# Altium schematic sheet [14]-CURRENT_METER.SchDoc
size A4
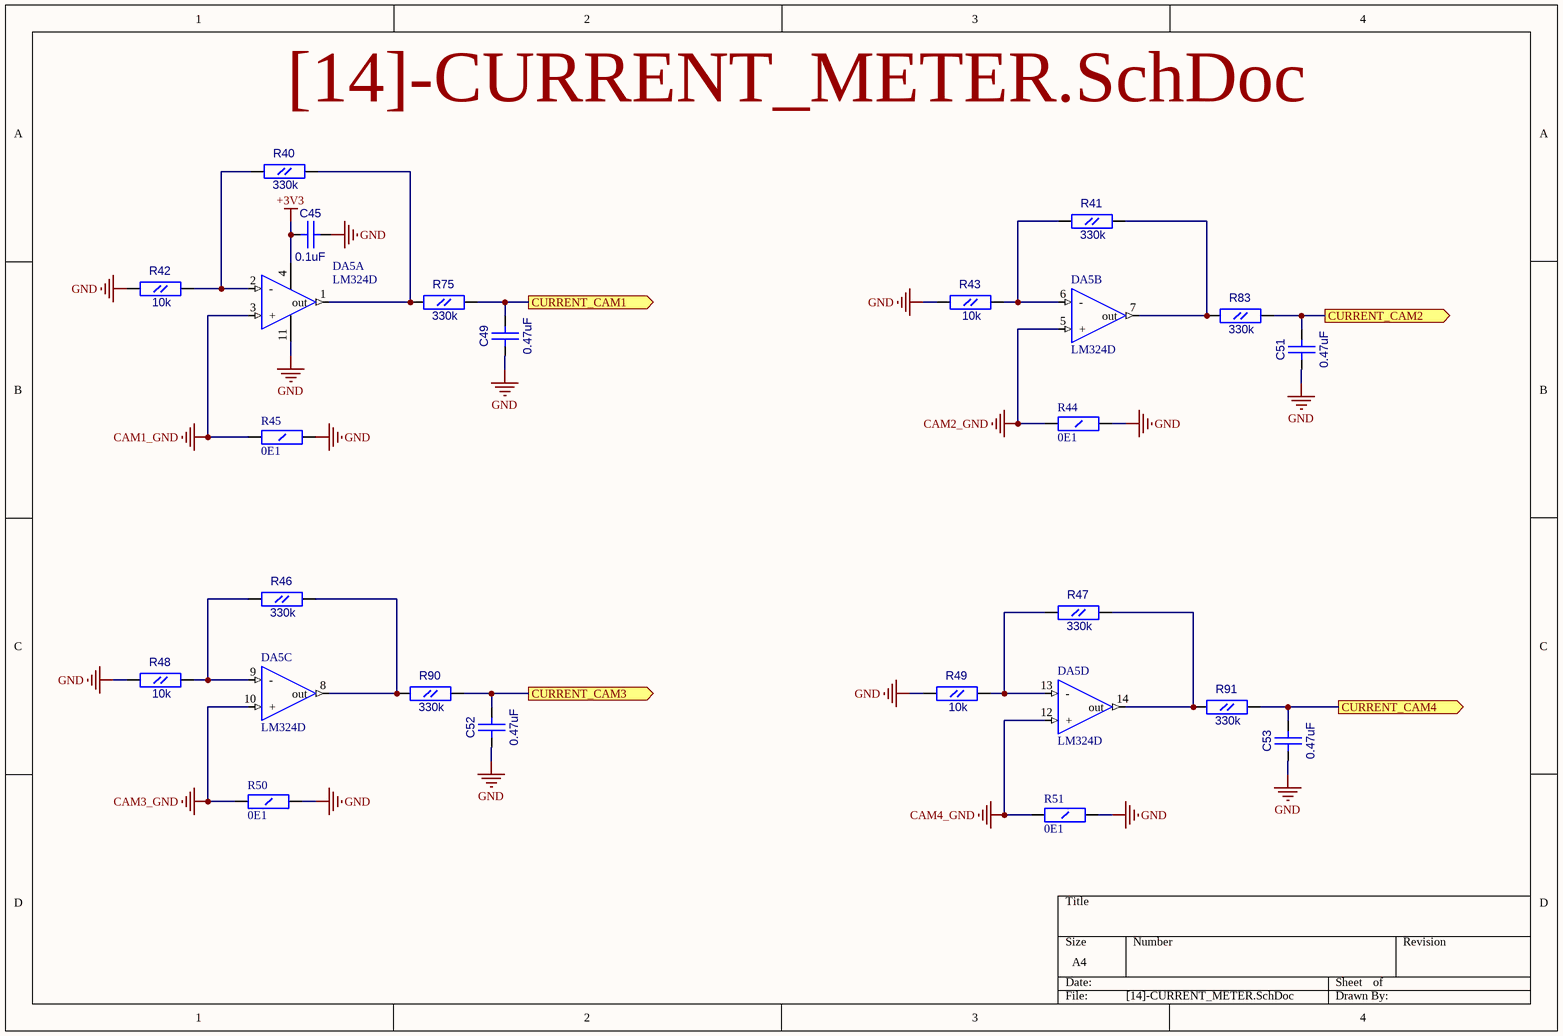
[diagram p0: [14]-CURRENT_METER.SchDoc]

## Parts
C45  0.1uF  [CC0603]
C49  0.47uF  [CC0603]
C51  0.47uF  [CC0603]
C52  0.47uF  [CC0603]
C53  0.47uF  [CC0603]
DA5  LM324D  [SO14]  (parts A,B,C,D of 4)
R40  330k  [RC0603]
R41  330k  [RC0603]
R42  10k  [RC0603]
R43  10k  [RC0603]
R44  0E1  [R2512]
R45  0E1  [R2512]
R46  330k  [RC0603]
R47  330k  [RC0603]
R48  10k  [RC0603]
R49  10k  [RC0603]
R50  0E1  [R2512]
R51  0E1  [R2512]
R75  330k  [RC0603]
R83  330k  [RC0603]
R90  330k  [RC0603]
R91  330k  [RC0603]

## Ports
CURRENT_CAM1 (out), CURRENT_CAM2 (out), CURRENT_CAM3 (out), CURRENT_CAM4 (out)

## Nets
+3V3: C45.1(A) DA5.4(V+)
CAM1_GND: DA5.3(+) R45.2(B)
CAM2_GND: DA5.5(+) R44.2(B)
CAM3_GND: DA5.10(+) R50.2(B)
CAM4_GND: DA5.12(+) R51.2(B)
GND: C45.2(B) C49.1(A) C51.1(A) C52.1(A) C53.1(A) DA5.11(V-) R42.1(A) R43.1(A) R44.1(A) R45.1(A) R48.1(A) R49.1(A) R50.1(A) R51.1(A)
CURRENT_CAM1: C49.2(B) R75.2(B) ; port CURRENT_CAM1
CURRENT_CAM2: C51.2(B) R83.2(B) ; port CURRENT_CAM2
CURRENT_CAM3: C52.2(B) R90.2(B) ; port CURRENT_CAM3
CURRENT_CAM4: C53.2(B) R91.2(B) ; port CURRENT_CAM4
NetDA5_1: DA5.1(out) R40.2(B) R75.1(A)
NetDA5_2: DA5.2(-) R40.1(A) R42.2(B)
NetDA5_6: DA5.6(-) R41.1(A) R43.2(B)
NetDA5_7: DA5.7(out) R41.2(B) R83.1(A)
NetDA5_8: DA5.8(out) R46.2(B) R90.1(A)
NetDA5_9: DA5.9(-) R46.1(A) R48.2(B)
NetDA5_13: DA5.13(-) R47.1(A) R49.2(B)
NetDA5_14: DA5.14(out) R47.2(B) R91.1(A)

## Library data of the parts
C45 C49 C51-C53 = CC0603
  C45: Value: 0.1uF
  C49 C51-C53: Value: 0.47uF
R40-R43 R46-R49 R75 R83 R90 R91 = RC0603
  R40 R41 R46 R47 R75 R83 R90 R91: Value: 330k
  R42 R43 R48 R49: Value: 10k
R44 R45 R50 R51 = RC2512: Resistor 2512 1W; Value: 0E1
DA5 = LM324D: Value: LM324D